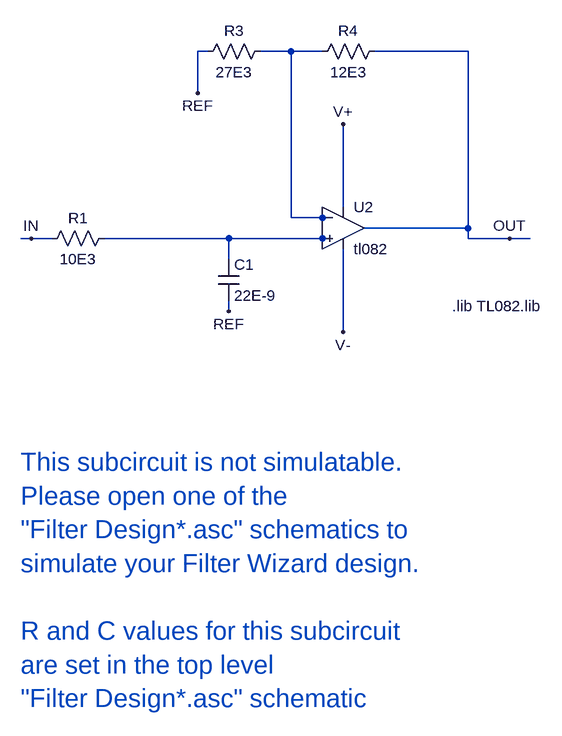
[diagram p0: schematic StageA_LowPassFirstOrderGain_ADA4096.asc]
StageA_LowPassFirstOrderGain_ADA4096.asc, the LTspice schematic file:
Version 4
SHEET 1 4112 860
WIRE 112 -128 96 -128
WIRE 240 -128 192 -128
WIRE 288 -128 240 -128
WIRE 512 -128 368 -128
WIRE 96 -64 96 -128
WIRE 320 112 320 -16
WIRE 240 128 240 -128
WIRE 288 128 288 112
WIRE 288 128 240 128
WIRE 304 128 288 128
WIRE 512 144 512 -128
WIRE 512 144 352 144
WIRE -160 160 -176 160
WIRE -128 160 -160 160
WIRE 144 160 -48 160
WIRE 288 160 144 160
WIRE 304 160 288 160
WIRE 512 160 512 144
WIRE 576 160 512 160
WIRE 608 160 576 160
WIRE 288 176 288 160
WIRE 144 192 144 160
WIRE 144 272 144 256
WIRE 320 304 320 176
FLAG 320 -16 V+
FLAG 320 304 V-
FLAG 576 160 OUT
FLAG -160 160 IN
FLAG 144 272 REF
FLAG 96 -64 REF
SYMBOL res -32 144 R90
WINDOW 0 0 56 VBottom 2
WINDOW 3 32 56 VTop 2
SYMATTR InstName R1
SYMATTR Value 10E3
SYMBOL cap 128 192 R0
SYMATTR InstName C1
SYMATTR Value 22E-9
SYMBOL res 272 -112 R270
WINDOW 0 32 56 VTop 2
WINDOW 3 0 56 VBottom 2
SYMATTR InstName R4
SYMATTR Value 12E3
SYMBOL res 96 -112 R270
WINDOW 0 32 56 VTop 2
WINDOW 3 0 56 VBottom 2
SYMATTR InstName R3
SYMATTR Value 27E3
SYMBOL Opamps\\opamp2 320 80 R0
SYMATTR InstName U2
SYMATTR Value tl082
TEXT -176 504 Left 4 ;This subcircuit is not simulatable.  \nPlease open one of the \n"Filter Design*.asc" schematics to \nsimulate your Filter Wizard design.\n \nR and C values for this subcircuit\nare set in the top level \n"Filter Design*.asc" schematic
TEXT 488 264 Left 2 !.lib TL082.lib

The netlist it stands for:
* StageA_LowPassFirstOrderGain_ADA4096.asc
R1 N002 IN 10E3
C1 N002 REF 22E-9
R4 N001 OUT 12E3
R3 REF N001 27E3
XU2 N002 N001 V+ V- OUT tl082  ; pins In+ In- V+ V- OUT
* This subcircuit is not simulatable.
* Please open one of the
* "Filter Design*.asc" schematics to
* simulate your Filter Wizard design.
* R and C values for this subcircuit
* are set in the top level
* "Filter Design*.asc" schematic
.lib TL082.lib
.backanno
.end